# EAGLE design HydroPi (EAGLE 6.4)
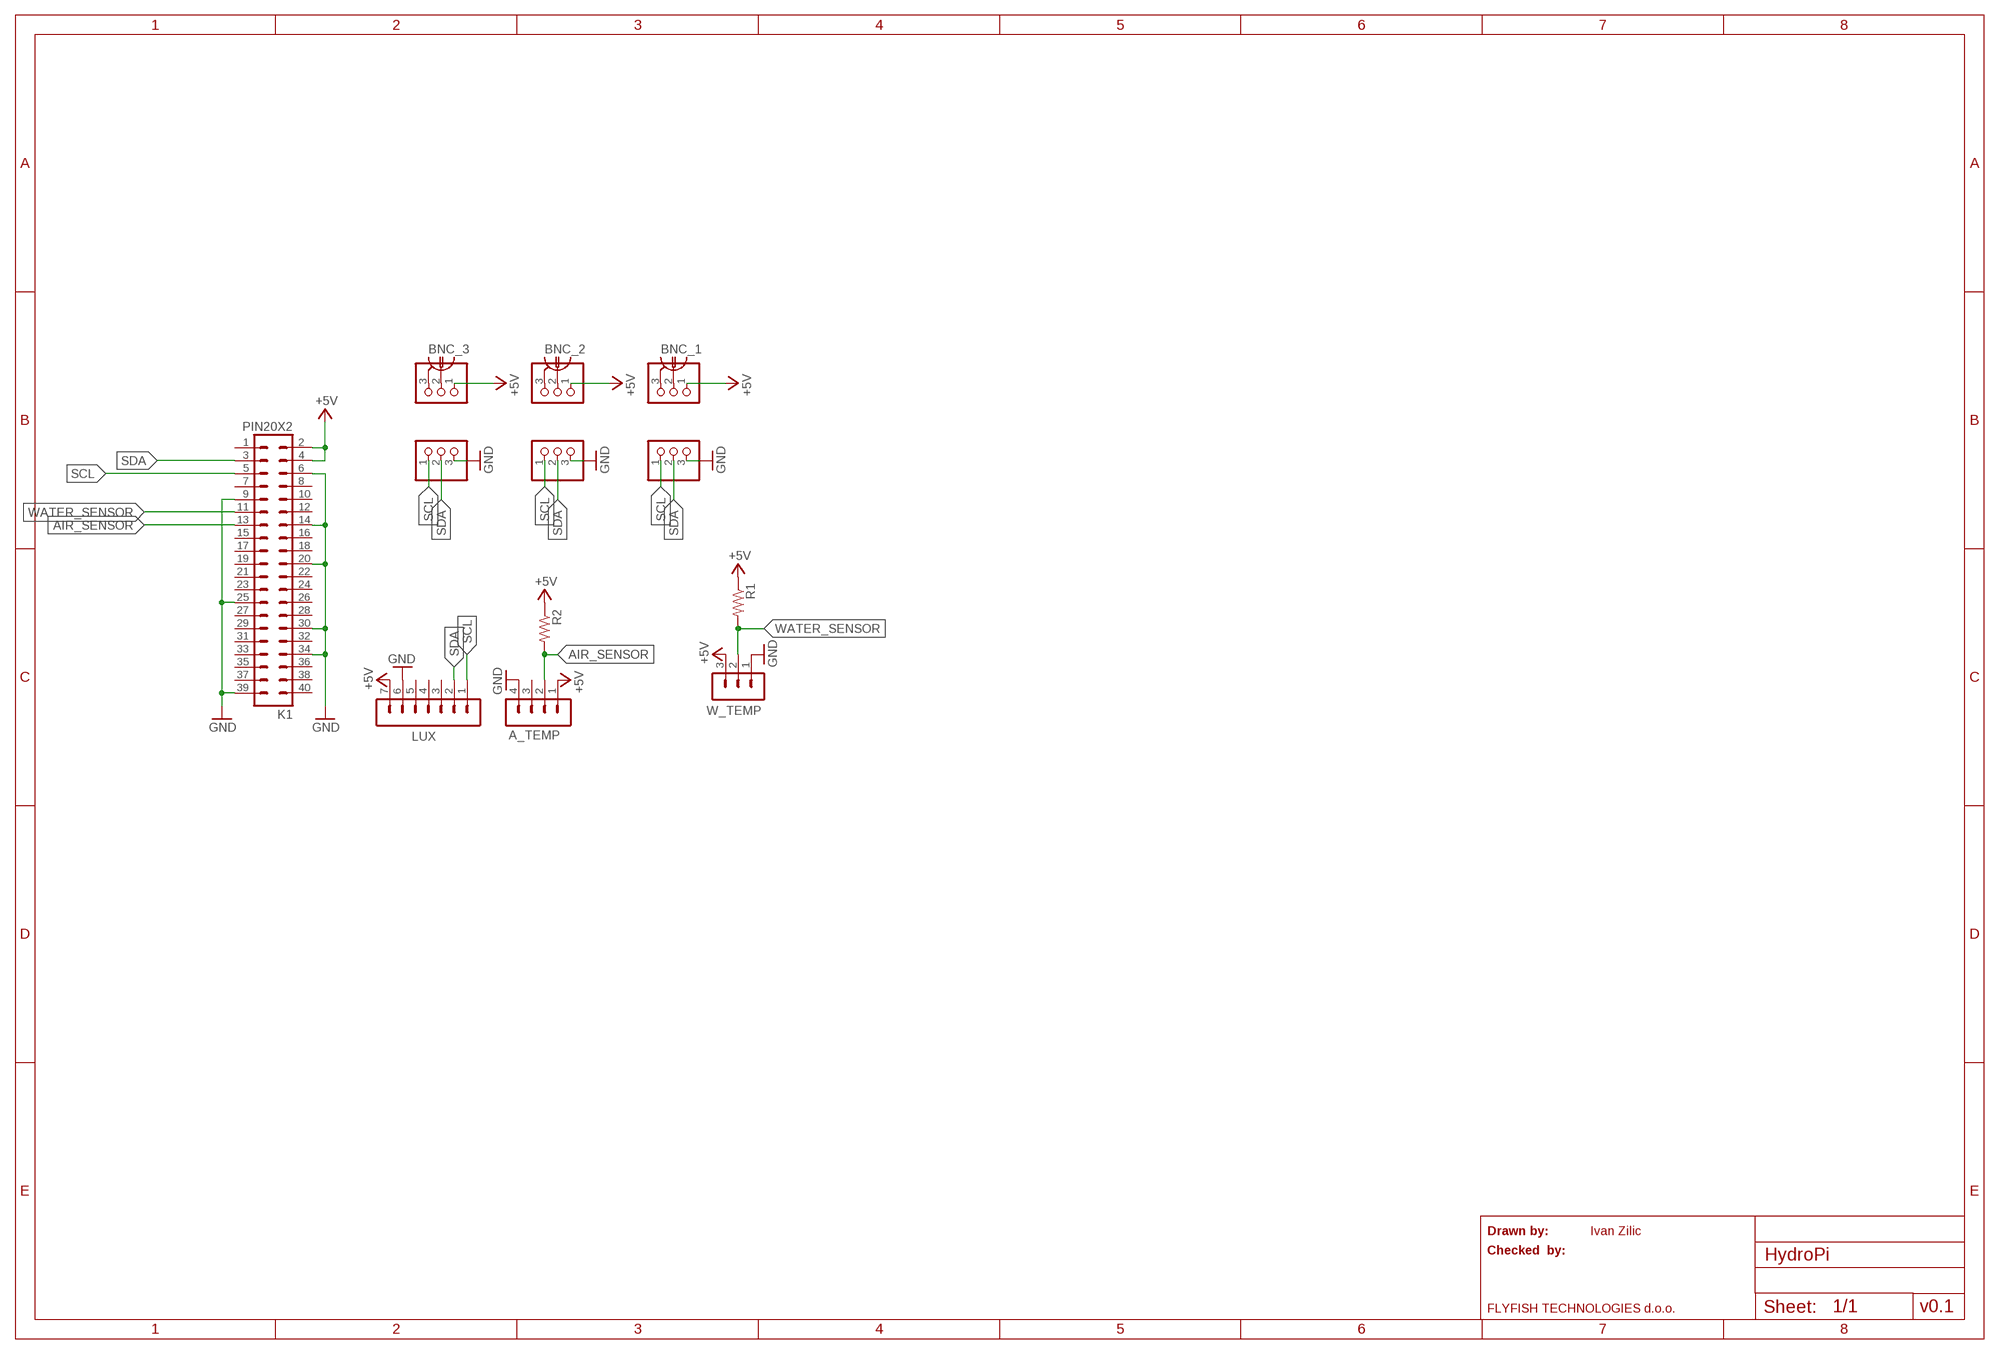
[diagram p0: schematic, sheet 1]

## Parts
A_TEMP  MA04-1  [MA04-1]
BNC_1  1-227161-0  [AMP_227161]
BNC_2  1-227161-0  [AMP_227161]
BNC_3  1-227161-0  [AMP_227161]
JP1  PINHD-1X3  [1X03]
JP2  PINHD-1X3  [1X03]
JP3  PINHD-1X3  [1X03]
JP4  PINHD-1X3  [1X03]
JP5  PINHD-1X3  [1X03]
JP6  PINHD-1X3  [1X03]
K1  PIN20X2  [PIN_20X2]
LUX  MA07-1  [MA07-1]
R1  R-US_R0805  [R0805]
R2  R-US_R0805  [R0805]
W_TEMP  MA03-1  [MA03-1]

## Nets
+5V: A_TEMP.1 JP1.1 JP2.1 JP5.1 K1.2 K1.4 LUX.7 R1.1 R2.1 W_TEMP.3
AIR_SENSOR: A_TEMP.2 K1.13 R2.2
GND: A_TEMP.4 JP3.3 JP4.3 JP6.3 K1.6 K1.9 K1.14 K1.20 K1.25 K1.30 K1.34 K1.39 LUX.6 W_TEMP.1
N$4: BNC_1.1 JP1.2
N$5: BNC_1.2 JP1.3
N$6: BNC_2.1 JP2.2
N$7: BNC_2.2 JP2.3
N$8: BNC_3.1 JP5.2
N$9: BNC_3.2 JP5.3
SCL: JP3.1 JP4.1 JP6.1 K1.5 LUX.1
SDA: JP3.2 JP4.2 JP6.2 K1.3 LUX.2
WATER_SENSOR: K1.11 R1.2 W_TEMP.2
Unconnected: A_TEMP.3 K1.1 K1.7 K1.8 K1.10 K1.12 K1.15 K1.16 K1.17 K1.18 K1.19 K1.21 K1.22 K1.23 K1.24 K1.26 K1.27 K1.28 K1.29 K1.31 K1.32 K1.33 K1.35 K1.36 K1.37 K1.38 K1.40 LUX.3 LUX.4 LUX.5

## Notes on the sheet
- Drawn by: | Ivan Zilic
- Checked  by:
- FLYFISH TECHNOLOGIES d.o.o. | v0.1

## Library data of the parts
A_TEMP = con-lstb:MA04-1: PIN HEADER; OC_FARNELL: unknown; OC_NEWARK: unknown
BNC_1-BNC_3 = con-coax:?227161*: JACK, RIGHT ANGLE, 50 OHM, PCB, BNC Source: amp_227161.pdf; MF: TYCO ELECTRONICS; MPN: 1-227161; OC_FARNELL: unknown; OC_NEWARK: 33B3200
JP1-JP6 = adafruit:PINHD-1X3: PIN HEADER
K1 = FLYFISH:PIN20X2
LUX = con-lstb:MA07-1: PIN HEADER; OC_FARNELL: unknown; OC_NEWARK: unknown
R1 R2 = adafruit:R-US_: RESISTOR, American symbol
W_TEMP = con-lstb:MA03-1: PIN HEADER; OC_FARNELL: unknown; OC_NEWARK: unknown

## Board
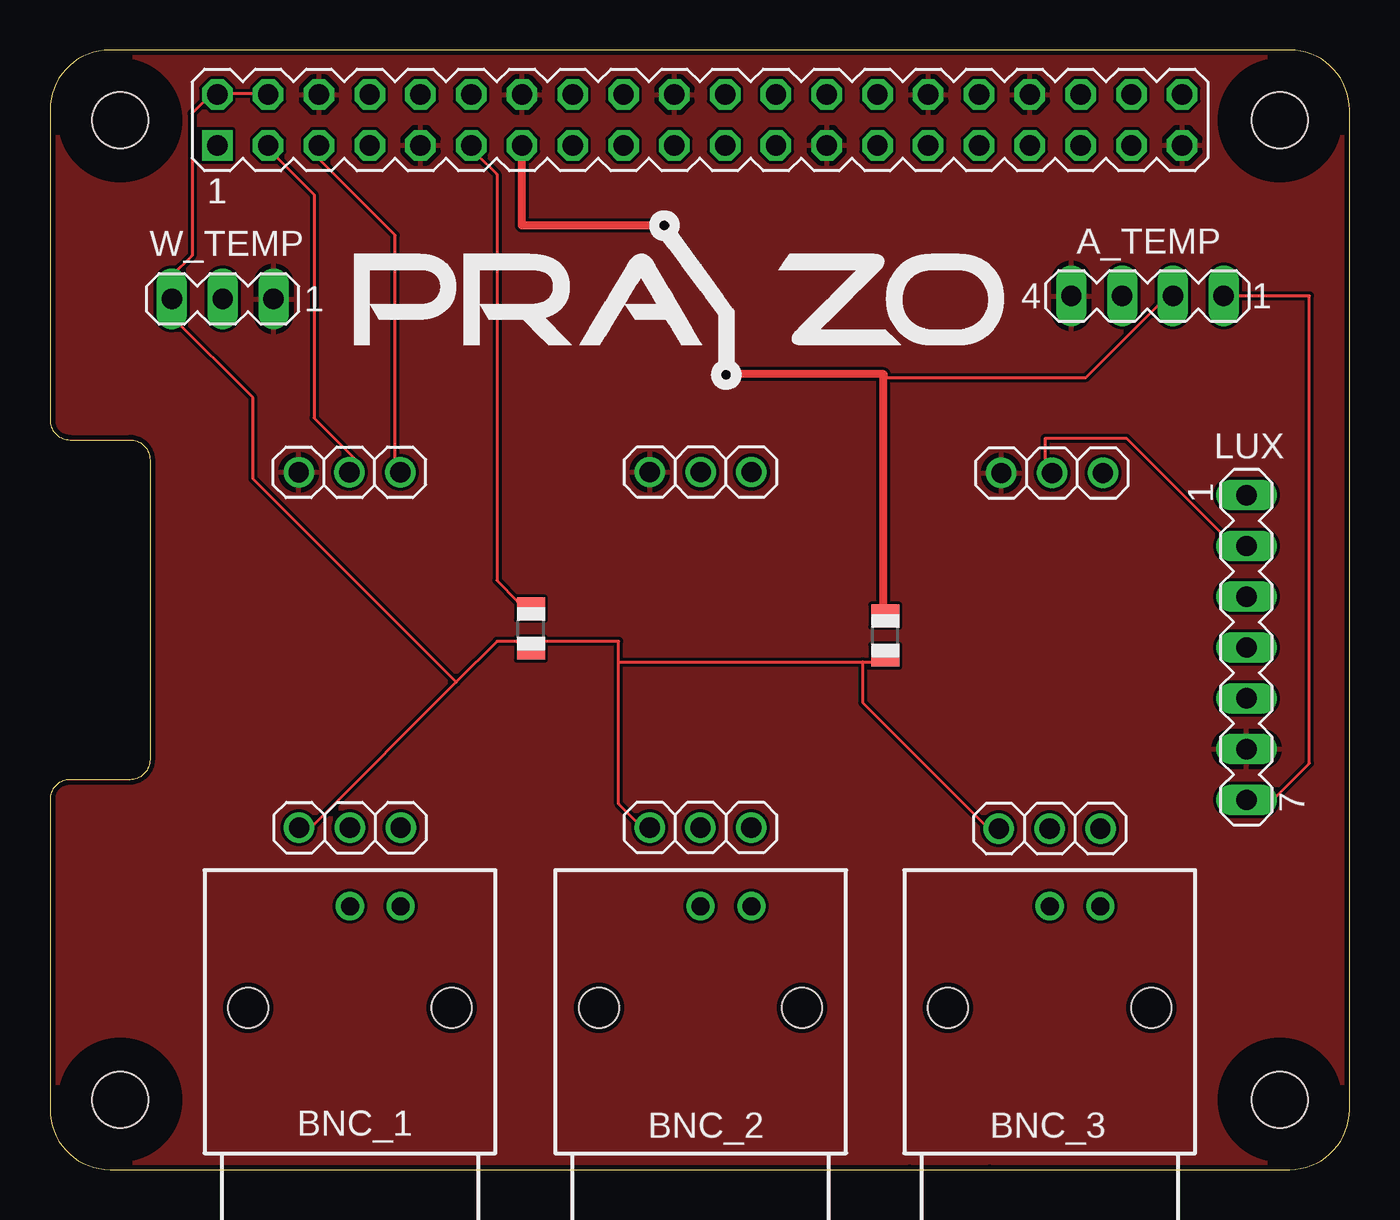
[diagram p1: board, top side]
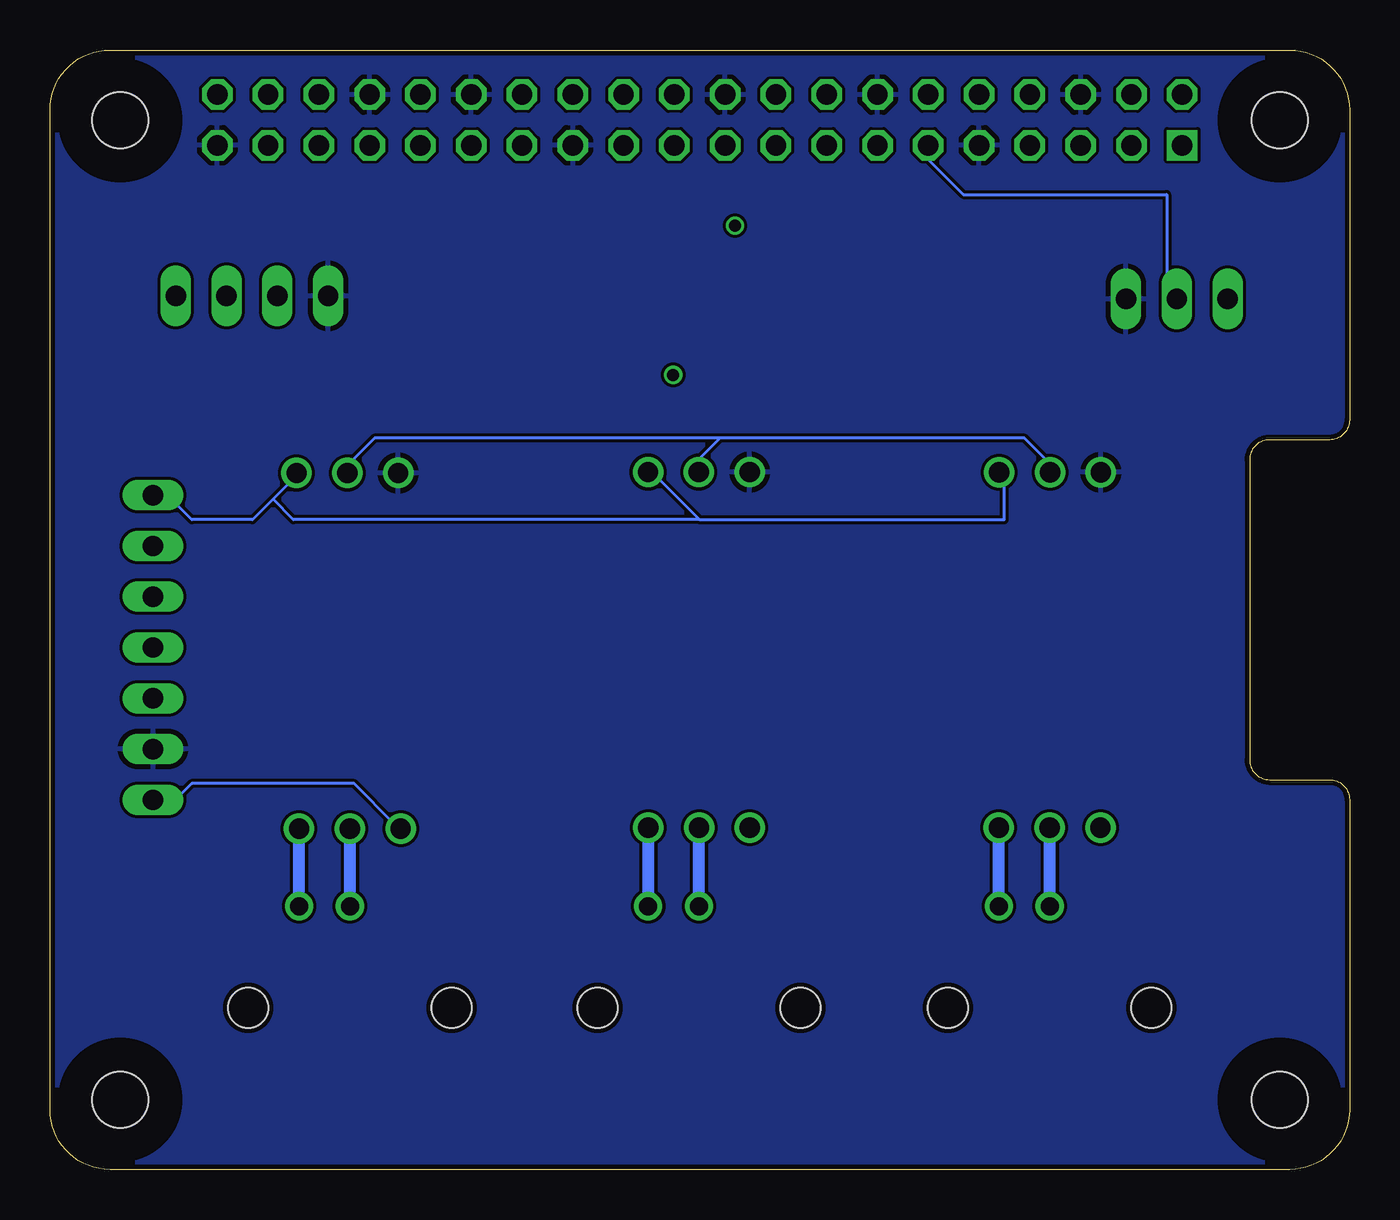
[diagram p2: board, bottom side, seen from below]

Size 65 x 56 mm. Coordinates in mm from the lower left corner, seen from the top.
Outline: 0,3 arc90 3,0 43,0 47,0 62,0 arc90 65,3 65,53 arc90 62,56 3,56 arc90 0,53 0,37.5 arc90 1,36.5 4,36.5 arc-90 5,35.5 5,20.5 arc-90 4,19.5 1,19.5 arc90 0,18.5 0,3
Copper layers (1*16): Top 0.035mm / dielectric 1.5mm / Bottom 0.035mm
Design rules "ITEADstudio_DRC": minimum track width 6mil, minimum drill 12mil, track to track 6mil, track to pad 6mil, pad to pad 6mil, via to via 6mil, smd to smd 0mil, copper to edge 10mil, drill to drill 10mil, minimum pad ring 10mil, minimum via ring 6mil, stop-mask expansion 2mil, vias tented up to drill 100mil, thermal gap 10mil
Holes 2.8 mm at 3.5,3.5 3.5,52.5 61.5,52.5 61.5,3.5
tRestrict: area 1.9,51 to 5,54; area 60,51 to 63,54; area 60,1.9 to 63,5; area 1.9,1.9 to 5,5
bRestrict: area 1.9,1.9 to 5,5; area 1.9,51 to 5,54; area 60,1.9 to 63,5; area 60,51 to 63,54

### Footprints (pad centres in the part's own frame; a part is rotated, then mirrored left to right if it is on the bottom)
MA04-1 = drill 1.016 long: 1 -3.81,0; 2 -1.27,0; 3 1.27,0; 4 3.81,0
AMP_227161 = drill 0.9 pad 1.27: 1 0,-5.08; 2 -2.54,-5.08 | hole 2: -5.08,0; 5.08,0
1X03 = drill 1.016: 1 -2.54,0; 2 0,0; 3 2.54,0
PIN_20X2 = drill 1.016 square: 1 -24.13,-1.27 | drill 1.016 octagon: 2 -24.13,1.27; 3 -21.59,-1.27; 4 -21.59,1.27; 5 -19.05,-1.27; 6 -19.05,1.27; 7 -16.51,-1.27; 8 -16.51,1.27; 9 -13.97,-1.27; 10 -13.97,1.27; 11 -11.43,-1.27; 12 -11.43,1.27; 13 -8.89,-1.27; 14 -8.89,1.27; 15 -6.35,-1.27; 16 -6.35,1.27; 17 -3.81,-1.27; 18 -3.81,1.27; 19 -1.27,-1.27; 20 -1.27,1.27; 21 1.27,-1.27; 22 1.27,1.27; 23 3.81,-1.27; 24 3.81,1.27; 25 6.35,-1.27; 26 6.35,1.27; 27 8.89,-1.27; 28 8.89,1.27; 29 11.43,-1.27; 30 11.43,1.27; 31 13.97,-1.27; 32 13.97,1.27; 33 16.51,-1.27; 34 16.51,1.27; 35 19.05,-1.27; 36 19.05,1.27; 37 21.59,-1.27; 38 21.59,1.27; 39 24.13,-1.27; 40 24.13,1.27
MA07-1 = drill 1.016 long: 1 -7.62,0; 2 -5.08,0; 3 -2.54,0; 4 0,0; 5 2.54,0; 6 5.08,0; 7 7.62,0
R0805 = smd 1.1 x 1.4: 1 -1,0; 2 1,0
MA03-1 = drill 1.016 long: 1 -2.54,0; 2 0,0; 3 2.54,0

### Placement (x,y rotation side)
A_TEMP  54.9,43.69 180 top
BNC_1  15,8.1 180 top
BNC_2  32.54,8.1 180 top
BNC_3  50,8.1 180 top
JP1  15,17.09 0 top
JP2  32.53,17.11 0 top
JP3  32.55,34.89 180 top
JP4  14.98,34.88 180 top
JP5  50,17.06 0 top
JP6  50.13,34.84 180 top
K1  32.5,52.5 0 top
LUX  59.84,26.11 270 top
R1  24.06,27.05 90 top
R2  41.78,26.7 90 top
W_TEMP  8.64,43.55 180 top

### Tracks (layer width: path | path; a pad name or v marks a point on that pad's centre or on a via)
+5V
  Top 0.152: 8.13,53.85 7.11,52.83 7.11,45.72 6.1,44.7 6.1,43.69 W_TEMP.3 6.1,42.67 10.16,38.61 10.16,34.54 20.32,24.38 | 8.13,53.85 K1.2 8.13,53.85 | 8.13,53.85 10.16,53.85 K1.4 | 28.45,25.4 28.45,18.29 29.46,17.27 JP2.1 | 28.45,25.4 28.45,26.42 24.38,26.42 R1.1 23.37,26.42 22.35,26.42 20.32,24.38 | 28.45,25.4 40.64,25.4 | 40.64,25.4 41.66,25.4 R2.1 | 20.32,24.38 13.21,17.27 JP1.1 | 40.64,25.4 40.64,23.37 46.74,17.27 JP5.1 | A_TEMP.1 58.93,43.69 62.99,43.69 62.99,20.32 60.96,18.29 59.94,18.29 LUX.7
  Bottom 0.152: LUX.7 58.93,18.29 57.91,19.3 49.78,19.3 47.75,17.27 JP5.1
AIR_SENSOR
  Top 0.152: 41.69,39.62 41.66,39.62 41.69,39.62 | 41.69,39.62 51.82,39.62 55.88,43.69 A_TEMP.2
  Top 0.406: R2.2 41.69,27.7 41.69,39.62 41.69,39.78 33.8,39.78 33.8,39.74 33.88,39.74 33.88,42.82 30.75,47.22 23.61,47.22 K1.13
GND
  pour Bottom: 0,3 arc90 3,0 62,0 arc90 65,3 65,53 arc90 62,56 3,56 arc90 0,53 0,37.5 arc90 1,36.5 4,36.5 arc-90 5,35.5 5,20.5 arc-90 4,19.5 1,19.5 arc90 0,18.5
  pour Top: 0,3 arc90 3,0 62,0 arc90 65,3 65,53 arc90 62,56 3,56 arc90 0,53 0,37.5 arc90 1,36.5 4,36.5 arc-90 5,35.5 5,20.5 arc-90 4,19.5 1,19.5 arc90 0,18.5
N$1  (via drill 0.6)
  other vias: 33.83,39.75
N$2  (via drill 0.6)
  other vias: 30.73,47.21
N$4
  Bottom 0.61: BNC_1.1 JP1.2
N$5
  Bottom 0.61: BNC_1.2 JP1.3
N$6
  Bottom 0.61: BNC_2.1 JP2.2
N$7
  Bottom 0.61: BNC_2.2 JP2.3
N$8
  Bottom 0.61: BNC_3.1 JP5.2
N$9
  Bottom 0.61: BNC_3.2 JP5.3
SCL
  Top 0.152: K1.5 13.21,50.8 17.27,46.74 17.27,35.56 JP4.1
  Bottom 0.152: 53.85,33.53 52.83,34.54 JP6.1 | 53.85,33.53 54.86,32.51 57.91,32.51 58.93,33.53 LUX.1 | 32.51,32.51 17.27,32.51 17.27,34.54 JP4.1 | 32.51,32.51 34.54,34.54 JP3.1 | 53.85,33.53 52.83,32.51 32.51,32.51
SDA
  Top 0.152: LUX.2 58.93,31.5 53.85,36.58 49.78,36.58 49.78,35.56 JP6.2 | JP4.2 15.24,35.56 13.21,37.59 13.21,48.77 11.18,50.8 K1.3
  Bottom 0.152: 31.5,36.58 32.51,35.56 JP3.2 | 31.5,36.58 16.26,36.58 15.24,35.56 JP4.2 | 31.5,36.58 48.77,36.58 49.78,35.56 JP6.2
WATER_SENSOR
  Top 0.152: R1.2 23.37,28.45 22.35,29.46 22.35,49.78 21.34,50.8 K1.11
  Bottom 0.152: W_TEMP.2 9.14,43.69 9.14,48.77 19.3,48.77 21.34,50.8 K1.11